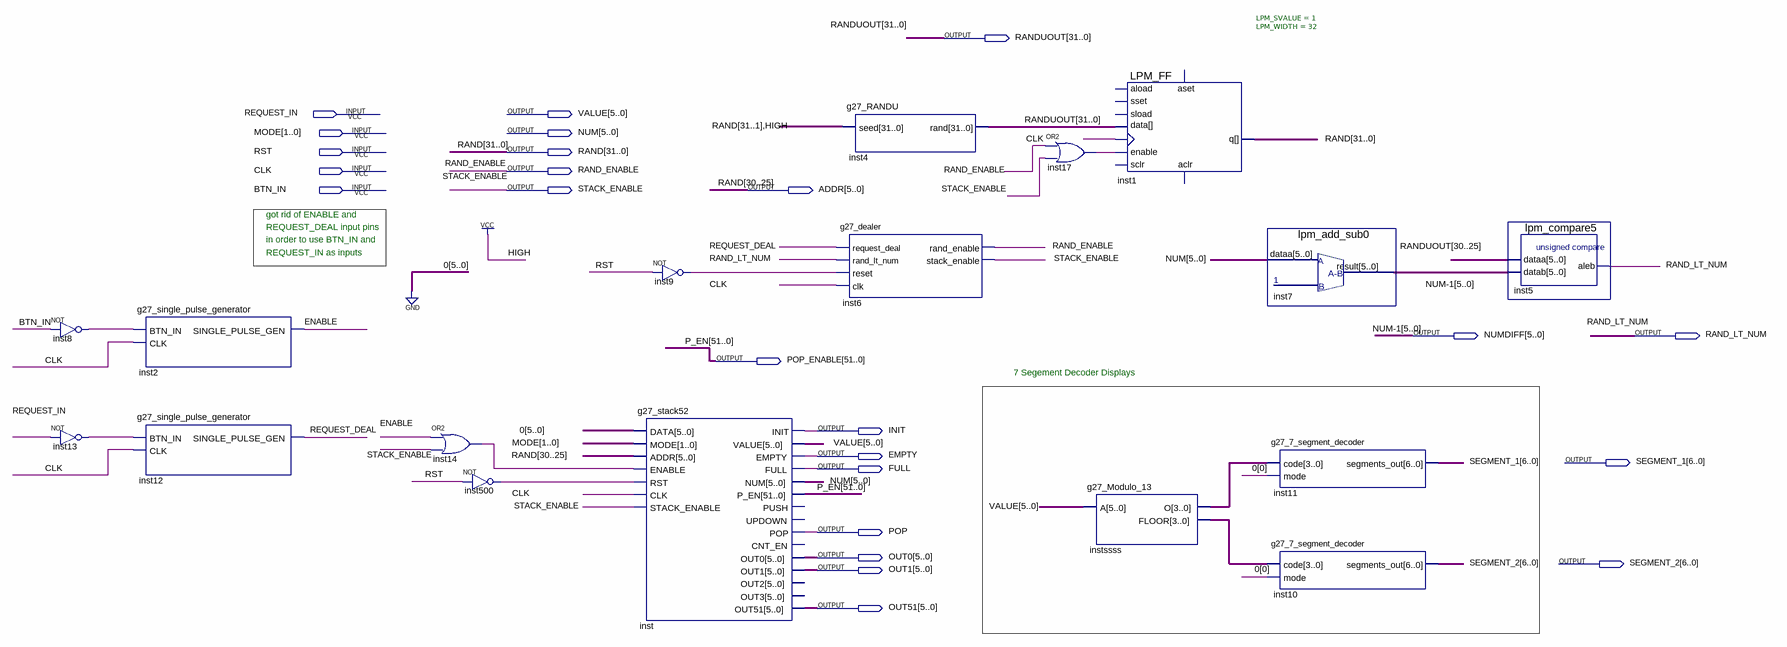
[diagram p0: schematic sheet]
// Quartus schematic g27_dealer_testbed.bdf as structural Verilog: 17 symbols, 24 pins
module g27_dealer_testbed (
  input  REQUEST_IN,
  input  [1:0] MODE,
  input  RST,
  input  CLK,
  input  BTN_IN,
  output [31:0] RANDUOUT,
  output [5:0] VALUE,
  output [5:0] NUM,
  output [31:0] RAND,
  output RAND_ENABLE,
  output STACK_ENABLE,
  output [5:0] ADDR,
  output [5:0] NUMDIFF,
  output RAND_LT_NUM,
  output [51:0] POP_ENABLE,
  output INIT,
  output EMPTY,
  output [6:0] SEGMENT_1,
  output FULL,
  output POP,
  output [5:0] OUT0,
  output [6:0] SEGMENT_2,
  output [5:0] OUT1,
  output [5:0] OUT51
);

  wire ENABLE, inst8_out, inst9_out, inst13_out, inst14_out, inst17_out, inst500_out, REQUEST_DEAL;
  wire [3:0] instssss_floor, instssss_o;

  not inst8 (inst8_out, BTN_IN);
  not inst13 (inst13_out, REQUEST_IN);
  g27_single_pulse_generator inst2 (.BTN_IN(inst8_out), .CLK(CLK), .SINGLE_PULSE_GEN(ENABLE));
  g27_single_pulse_generator inst12 (.BTN_IN(inst13_out), .CLK(CLK), .SINGLE_PULSE_GEN(REQUEST_DEAL));
  or inst14 (inst14_out, ENABLE, STACK_ENABLE);
  not inst500 (inst500_out, RST);
  g27_stack52 inst (
    .DATA({6{1'b0}}), .MODE(MODE), .ADDR(ADDR), .ENABLE(inst14_out), .RST(inst500_out), .CLK(CLK),
    .STACK_ENABLE(STACK_ENABLE), .INIT(INIT), .VALUE(VALUE), .EMPTY(EMPTY), .FULL(FULL), .NUM(NUM),
    .P_EN(POP_ENABLE), .POP(POP), .OUT0(OUT0), .OUT1(OUT1), .OUT51(OUT51));  // open: PUSH, UPDOWN, CNT_EN, OUT2, OUT3
  not inst9 (inst9_out, RST);
  g27_RANDU inst4 (.seed({RAND[31], ADDR, RAND[24:1], 1'b1}), .\rand (RANDUOUT));
  g27_dealer inst6 (
    .request_deal(REQUEST_DEAL), .rand_lt_num(RAND_LT_NUM), .reset(inst9_out), .clk(CLK),
    .rand_enable(RAND_ENABLE), .stack_enable(STACK_ENABLE));
  or inst17 (inst17_out, RAND_ENABLE, STACK_ENABLE);
  g27_Modulo_13 instssss (.A(VALUE), .O(instssss_o), .FLOOR(instssss_floor));
  LPM_FF #(.LPM_SVALUE(1), .LPM_WIDTH(32)) inst1 (
    .enable(inst17_out), .clock(CLK), .data(RANDUOUT), .q({RAND[31], ADDR, RAND[24:0]}));  // open: aload, sset, sload, aset, sclr, aclr
  lpm_add_sub0 inst7 (.dataa(NUM), .result(NUMDIFF));
  g27_7_segment_decoder inst11 (.code(instssss_o), .mode(1'b0), .segments_out(SEGMENT_1));
  g27_7_segment_decoder inst10 (.code(instssss_floor), .mode(1'b0), .segments_out(SEGMENT_2));
  lpm_compare5 inst5 (.dataa(RANDUOUT[30:25]), .datab(NUMDIFF), .aleb(RAND_LT_NUM));

  assign RAND[30:25] = ADDR;

  // Other names for the same wires on the sheet: NUM-1[5:0] = NUMDIFF; P_EN[51:0] = POP_ENABLE

  // Notes on the sheet:
  //   got rid of ENABLE and 
  //   REQUEST_DEAL input pins
  //   in order to use BTN_IN and 
  //   REQUEST_IN as inputs
  //   7 Segement Decoder Displays
endmodule
